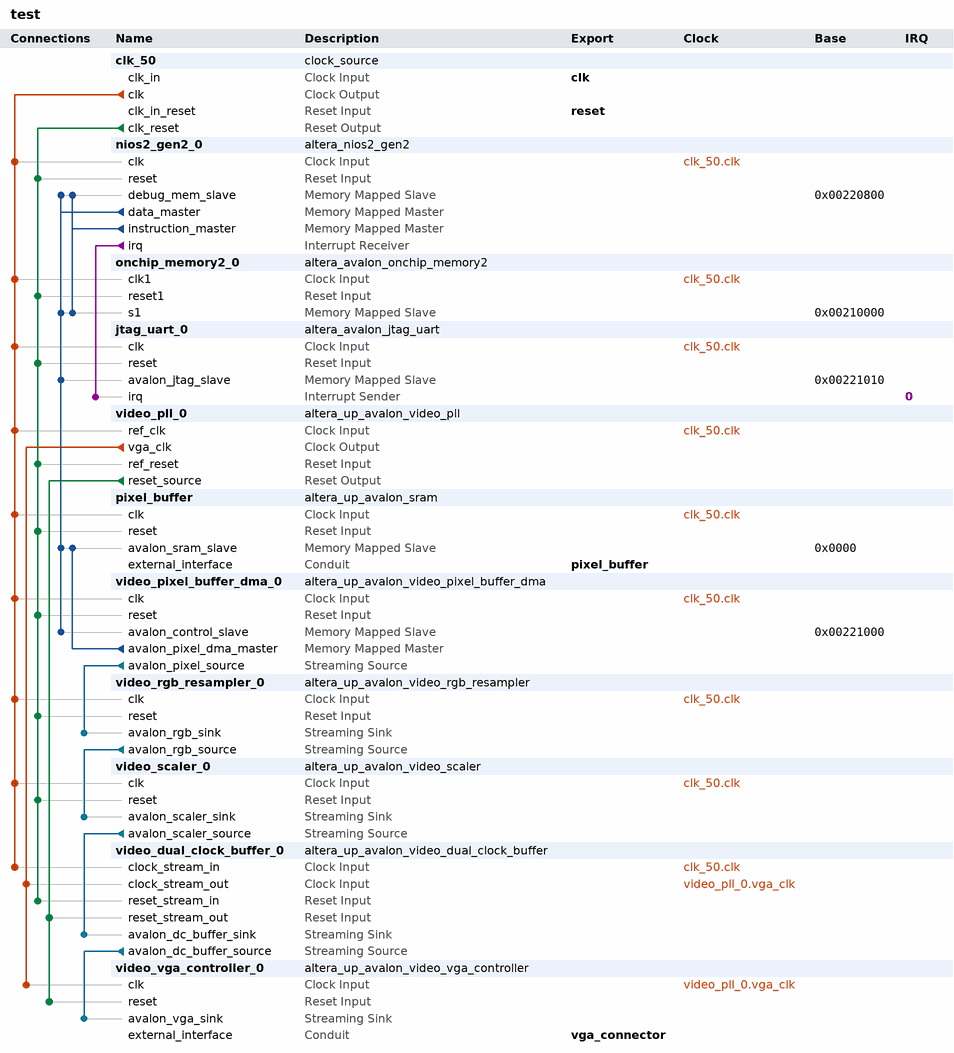
[diagram p0: system contents]
# Platform Designer (Qsys) system test, Cyclone IV E EP4CE115F29C7
# Parameters at their usual value, and those the tool derives, are not listed.
package require -exact qsys 16.1
create_system test
set_project_property DEVICE_FAMILY {Cyclone IV E}
set_project_property DEVICE EP4CE115F29C7

add_instance clk_50 clock_source 16.1
set_instance_parameter_value clk_50 clockFrequency 50000000

add_instance nios2_gen2_0 altera_nios2_gen2 16.1
set_instance_parameter_value nios2_gen2_0 dcache_size 2048
set_instance_parameter_value nios2_gen2_0 exceptionSlave onchip_memory2_0.s1
set_instance_parameter_value nios2_gen2_0 icache_size 4096
set_instance_parameter_value nios2_gen2_0 impl Fast
set_instance_parameter_value nios2_gen2_0 resetSlave onchip_memory2_0.s1

add_instance onchip_memory2_0 altera_avalon_onchip_memory2 16.1
set_instance_parameter_value onchip_memory2_0 dataWidth 32
set_instance_parameter_value onchip_memory2_0 dualPort false
set_instance_parameter_value onchip_memory2_0 initMemContent true
set_instance_parameter_value onchip_memory2_0 initializationFileName onchip_mem.hex
set_instance_parameter_value onchip_memory2_0 memorySize 40096

add_instance jtag_uart_0 altera_avalon_jtag_uart 16.1
set_instance_parameter_value jtag_uart_0 simInteractiveOptions NO_INTERACTIVE_WINDOWS

add_instance video_pll_0 altera_up_avalon_video_pll 16.1
set_instance_parameter_value video_pll_0 camera {5MP Digital Camera}
set_instance_parameter_value video_pll_0 gui_refclk 50.0
set_instance_parameter_value video_pll_0 lcd {7" LCD on VEEK-MT and MTL Module}
set_instance_parameter_value video_pll_0 lcd_clk_en true
set_instance_parameter_value video_pll_0 video_in_clk_en true

add_instance pixel_buffer altera_up_avalon_sram 16.1
set_instance_parameter_value pixel_buffer board DE2-115
set_instance_parameter_value pixel_buffer pixel_buffer true

add_instance video_pixel_buffer_dma_0 altera_up_avalon_video_pixel_buffer_dma 16.1
set_instance_parameter_value video_pixel_buffer_dma_0 addr_mode X-Y
set_instance_parameter_value video_pixel_buffer_dma_0 back_start_address 0
set_instance_parameter_value video_pixel_buffer_dma_0 color_space {24-bit RGB}
set_instance_parameter_value video_pixel_buffer_dma_0 image_height 480
set_instance_parameter_value video_pixel_buffer_dma_0 image_width 640
set_instance_parameter_value video_pixel_buffer_dma_0 start_address 0

add_instance video_rgb_resampler_0 altera_up_avalon_video_rgb_resampler 16.1
set_instance_parameter_value video_rgb_resampler_0 alpha 1023
set_instance_parameter_value video_rgb_resampler_0 input_type {24-bit RGB}
set_instance_parameter_value video_rgb_resampler_0 output_type {30-bit RGB}

add_instance video_scaler_0 altera_up_avalon_video_scaler 16.1
set_instance_parameter_value video_scaler_0 color_bits 10
set_instance_parameter_value video_scaler_0 color_planes 3
set_instance_parameter_value video_scaler_0 height_scaling 2
set_instance_parameter_value video_scaler_0 width_in 640
set_instance_parameter_value video_scaler_0 width_scaling 2

add_instance video_dual_clock_buffer_0 altera_up_avalon_video_dual_clock_buffer 16.1
set_instance_parameter_value video_dual_clock_buffer_0 color_bits 10

add_instance video_vga_controller_0 altera_up_avalon_video_vga_controller 16.1
set_instance_parameter_value video_vga_controller_0 board DE2-115
set_instance_parameter_value video_vga_controller_0 resolution {VGA 640x480}

# connections
add_connection clk_50.clk jtag_uart_0.clk clock
add_connection clk_50.clk nios2_gen2_0.clk clock
add_connection clk_50.clk onchip_memory2_0.clk1 clock
add_connection clk_50.clk pixel_buffer.clk clock
add_connection clk_50.clk video_dual_clock_buffer_0.clock_stream_in clock
add_connection clk_50.clk video_pixel_buffer_dma_0.clk clock
add_connection clk_50.clk video_pll_0.ref_clk clock
add_connection clk_50.clk video_rgb_resampler_0.clk clock
add_connection clk_50.clk video_scaler_0.clk clock
add_connection video_pll_0.vga_clk video_dual_clock_buffer_0.clock_stream_out clock
add_connection video_pll_0.vga_clk video_vga_controller_0.clk clock
add_connection clk_50.clk_reset jtag_uart_0.reset reset
add_connection clk_50.clk_reset nios2_gen2_0.reset reset
add_connection clk_50.clk_reset onchip_memory2_0.reset1 reset
add_connection clk_50.clk_reset pixel_buffer.reset reset
add_connection clk_50.clk_reset video_dual_clock_buffer_0.reset_stream_in reset
add_connection clk_50.clk_reset video_pixel_buffer_dma_0.reset reset
add_connection clk_50.clk_reset video_pll_0.ref_reset reset
add_connection clk_50.clk_reset video_rgb_resampler_0.reset reset
add_connection clk_50.clk_reset video_scaler_0.reset reset
add_connection video_pll_0.reset_source video_dual_clock_buffer_0.reset_stream_out reset
add_connection video_pll_0.reset_source video_vga_controller_0.reset reset
add_connection nios2_gen2_0.data_master jtag_uart_0.avalon_jtag_slave avalon
set_connection_parameter_value nios2_gen2_0.data_master/jtag_uart_0.avalon_jtag_slave baseAddress 0x00221010
add_connection nios2_gen2_0.data_master nios2_gen2_0.debug_mem_slave avalon
set_connection_parameter_value nios2_gen2_0.data_master/nios2_gen2_0.debug_mem_slave baseAddress 0x00220800
add_connection nios2_gen2_0.data_master onchip_memory2_0.s1 avalon
set_connection_parameter_value nios2_gen2_0.data_master/onchip_memory2_0.s1 baseAddress 0x00210000
add_connection nios2_gen2_0.data_master pixel_buffer.avalon_sram_slave avalon
set_connection_parameter_value nios2_gen2_0.data_master/pixel_buffer.avalon_sram_slave baseAddress 0x0000
add_connection nios2_gen2_0.data_master video_pixel_buffer_dma_0.avalon_control_slave avalon
set_connection_parameter_value nios2_gen2_0.data_master/video_pixel_buffer_dma_0.avalon_control_slave baseAddress 0x00221000
add_connection nios2_gen2_0.instruction_master nios2_gen2_0.debug_mem_slave avalon
set_connection_parameter_value nios2_gen2_0.instruction_master/nios2_gen2_0.debug_mem_slave baseAddress 0x00220800
add_connection nios2_gen2_0.instruction_master onchip_memory2_0.s1 avalon
set_connection_parameter_value nios2_gen2_0.instruction_master/onchip_memory2_0.s1 baseAddress 0x00210000
add_connection video_pixel_buffer_dma_0.avalon_pixel_dma_master pixel_buffer.avalon_sram_slave avalon
set_connection_parameter_value video_pixel_buffer_dma_0.avalon_pixel_dma_master/pixel_buffer.avalon_sram_slave baseAddress 0x0000
add_connection video_dual_clock_buffer_0.avalon_dc_buffer_source video_vga_controller_0.avalon_vga_sink avalon_streaming
add_connection video_pixel_buffer_dma_0.avalon_pixel_source video_rgb_resampler_0.avalon_rgb_sink avalon_streaming
add_connection video_rgb_resampler_0.avalon_rgb_source video_scaler_0.avalon_scaler_sink avalon_streaming
add_connection video_scaler_0.avalon_scaler_source video_dual_clock_buffer_0.avalon_dc_buffer_sink avalon_streaming
add_connection nios2_gen2_0.irq jtag_uart_0.irq interrupt
set_connection_parameter_value nios2_gen2_0.irq/jtag_uart_0.irq irqNumber 0

# exported interfaces
add_interface clk clock sink
set_interface_property clk EXPORT_OF clk_50.clk_in
add_interface pixel_buffer conduit end
set_interface_property pixel_buffer EXPORT_OF pixel_buffer.external_interface
add_interface reset reset sink
set_interface_property reset EXPORT_OF clk_50.clk_in_reset
add_interface vga_connector conduit end
set_interface_property vga_connector EXPORT_OF video_vga_controller_0.external_interface

set_interconnect_requirement {$system} qsys_mm.clockCrossingAdapter HANDSHAKE
set_interconnect_requirement {$system} qsys_mm.enableEccProtection FALSE
set_interconnect_requirement {$system} qsys_mm.insertDefaultSlave FALSE
set_interconnect_requirement {$system} qsys_mm.maxAdditionalLatency 1

save_system test.qsys
